# EAGLE design a406-4069-overdrive (EAGLE 7.5.1)
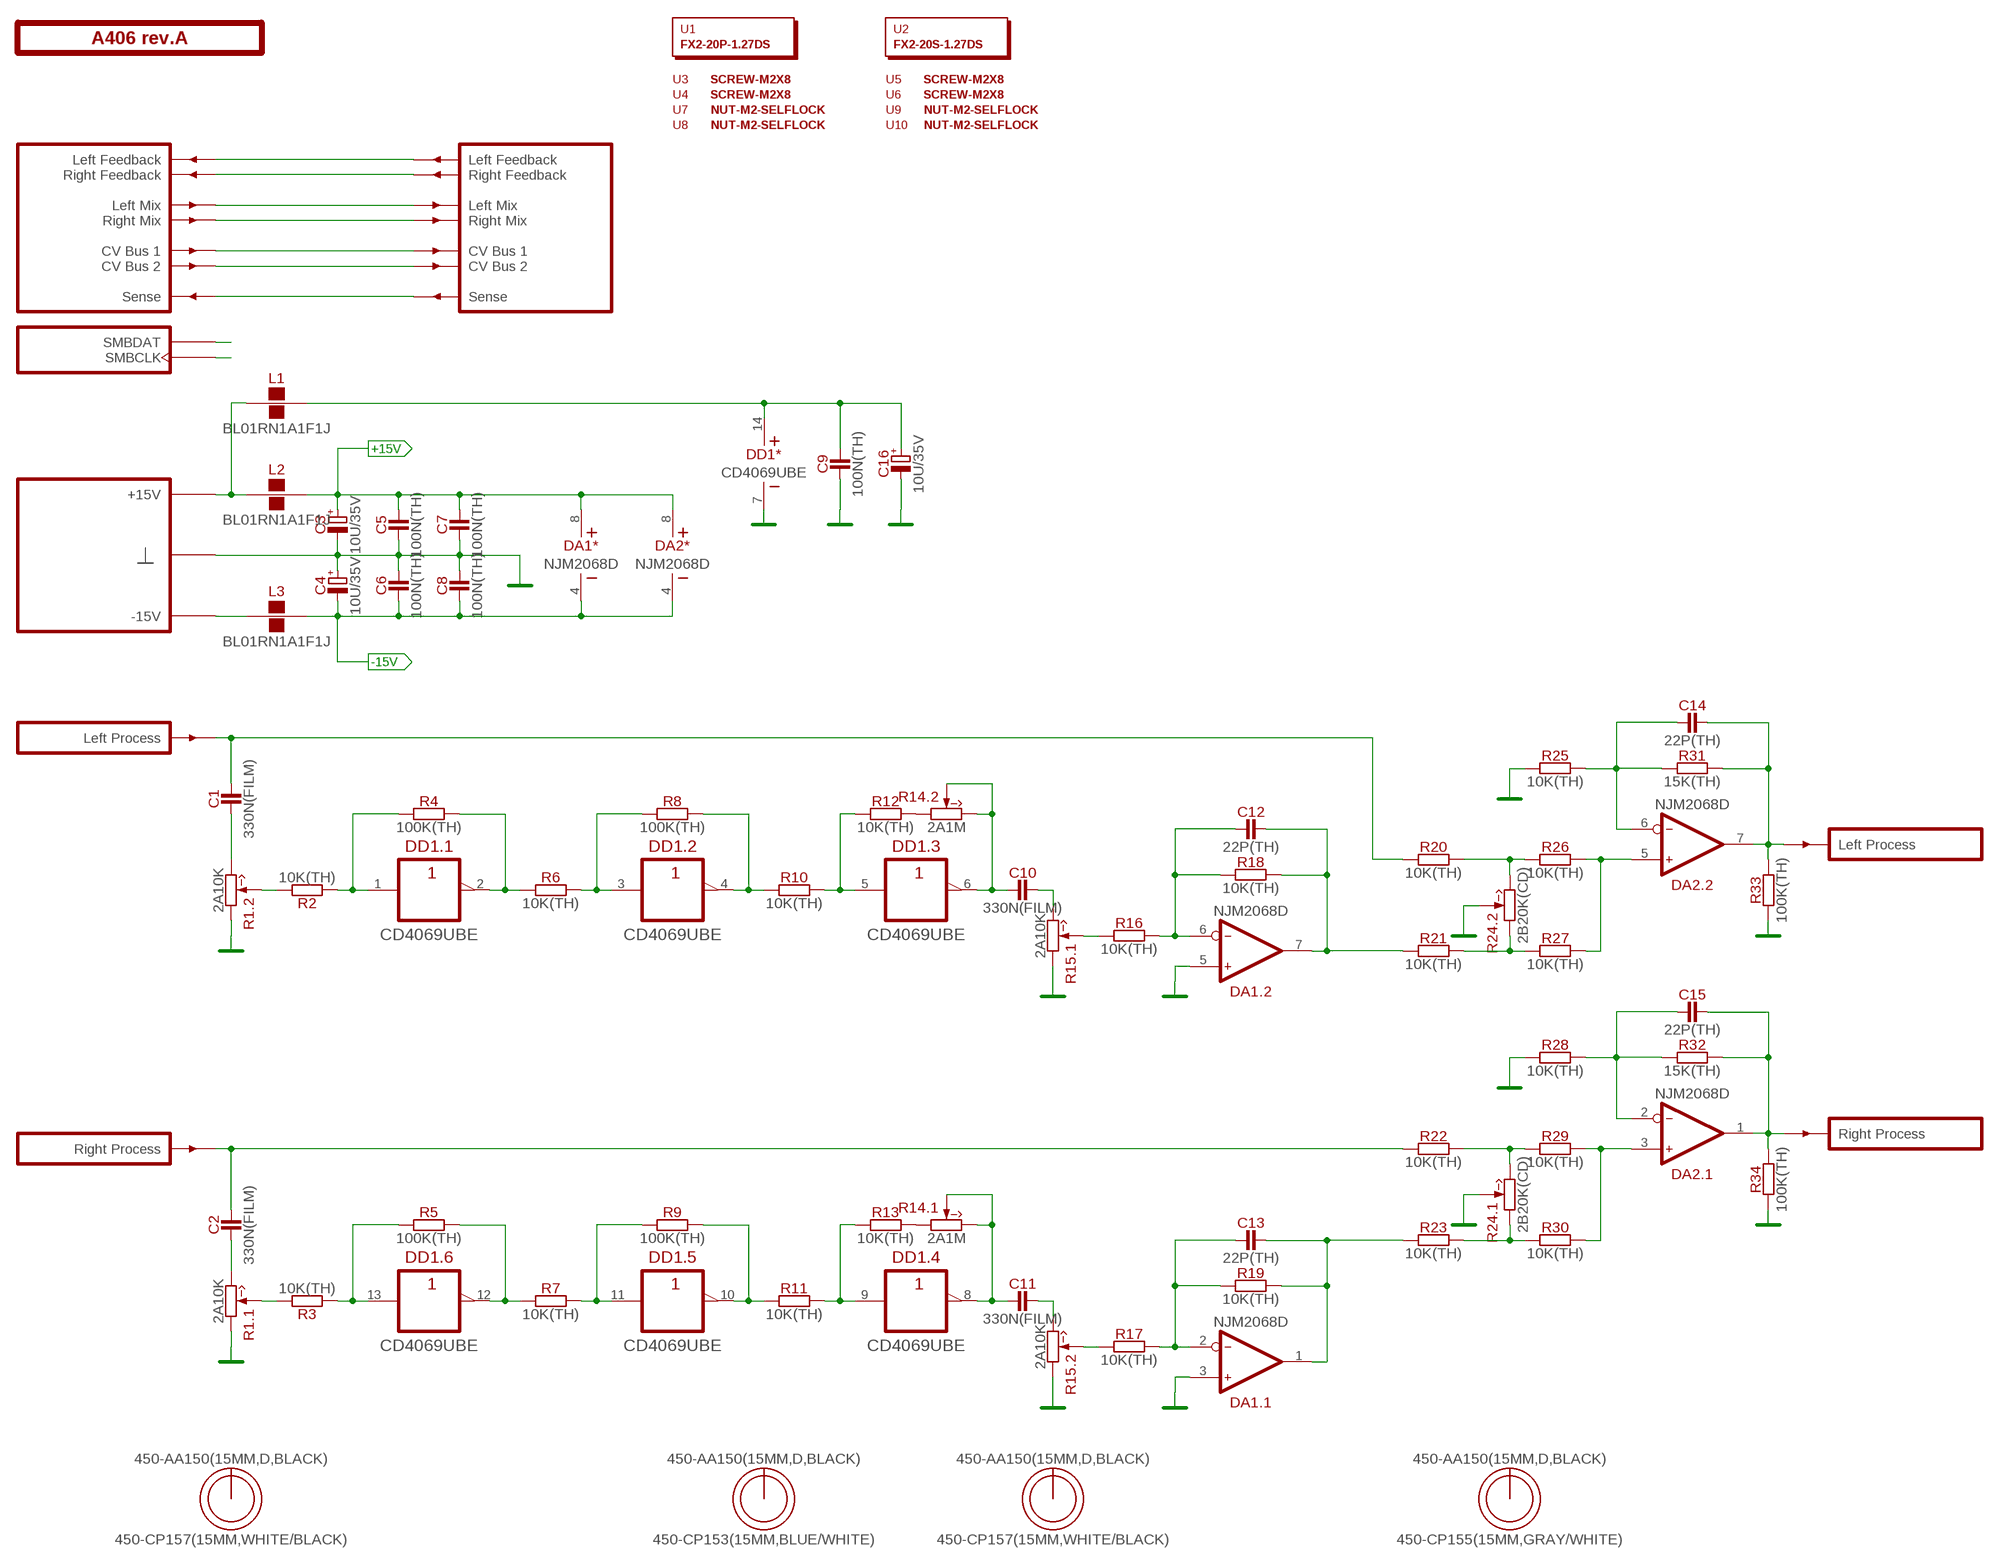
[diagram p0: schematic, sheet 1]

## Parts
C1  330N(FILM)  [C050-035X075]
C2  330N(FILM)  [C050-035X075]
C3  10U/35V  [E2-5]
C4  10U/35V  [E2-5]
C5  100N(TH)  [C050-024X044]
C6  100N(TH)  [C050-024X044]
C7  100N(TH)  [C050-024X044]
C8  100N(TH)  [C050-024X044]
C9  100N(TH)  [C050-024X044]
C10  330N(FILM)  [C050-035X075]
C11  330N(FILM)  [C050-035X075]
C12  22P(TH)  [C050-024X044]
C13  22P(TH)  [C050-024X044]
C14  22P(TH)  [C050-024X044]
C15  22P(TH)  [C050-024X044]
C16  10U/35V  [E2-5]
DA1  NJM2068D  [DIP-8]
DA2  NJM2068D  [DIP-8]
DD1  CD4069UBE  [DIP-14]
L1  BL01RN1A1F1J  [BL01RN1A]
L2  BL01RN1A1F1J  [BL01RN1A]
L3  BL01RN1A1F1J  [BL01RN1A]
O2  450-AA150(15MM,D,BLACK)  [EMPTY]
O3  450-CP157(15MM,WHITE/BLACK)  [EMPTY]
O4  450-AA150(15MM,D,BLACK)  [EMPTY]
O5  450-CP153(15MM,BLUE/WHITE)  [EMPTY]
O6  450-AA150(15MM,D,BLACK)  [EMPTY]
O7  450-CP157(15MM,WHITE/BLACK)  [EMPTY]
O8  450-AA150(15MM,D,BLACK)  [EMPTY]
O9  450-CP155(15MM,GRAY/WHITE)  [EMPTY]
PCB1  A406 rev.A  ST2-BOARD-50  [ST2-BOARD-50]
R1  2A10K  [RV11-DUAL]
R2  10K(TH)  [R-0207/10]
R3  10K(TH)  [R-0207/10]
R4  100K(TH)  [R-0207/10]
R5  100K(TH)  [R-0207/10]
R6  10K(TH)  [R-0207/10]
R7  10K(TH)  [R-0207/10]
R8  100K(TH)  [R-0207/10]
R9  100K(TH)  [R-0207/10]
R10  10K(TH)  [R-0207/10]
R11  10K(TH)  [R-0207/10]
R12  10K(TH)  [R-0207/10]
R13  10K(TH)  [R-0207/10]
R14  2A1M  [RV11-DUAL]
R15  2A10K  [RV11-DUAL]
R16  10K(TH)  [R-0207/10]
R17  10K(TH)  [R-0207/10]
R18  10K(TH)  [R-0207/10]
R19  10K(TH)  [R-0207/10]
R20  10K(TH)  [R-0207/10]
R21  10K(TH)  [R-0207/10]
R22  10K(TH)  [R-0207/10]
R23  10K(TH)  [R-0207/10]
R24  2B20K(CD)  [RV11-DUAL]
R25  10K(TH)  [R-0207/10]
R26  10K(TH)  [R-0207/10]
R27  10K(TH)  [R-0207/10]
R28  10K(TH)  [R-0207/10]
R29  10K(TH)  [R-0207/10]
R30  10K(TH)  [R-0207/10]
R31  15K(TH)  [R-0207/10]
R32  15K(TH)  [R-0207/10]
R33  100K(TH)  [R-0207/10]
R34  100K(TH)  [R-0207/10]
U1  FX2-20P-1.27DS  [EMPTY]
U2  FX2-20S-1.27DS  [EMPTY]
U3  SCREW-M2X8  [EMPTY]
U4  SCREW-M2X8  [EMPTY]
U5  SCREW-M2X8  [EMPTY]
U6  SCREW-M2X8  [EMPTY]
U7  NUT-M2-SELFLOCK  [EMPTY]
U8  NUT-M2-SELFLOCK  [EMPTY]
U9  NUT-M2-SELFLOCK  [EMPTY]
U10  NUT-M2-SELFLOCK  [EMPTY]

## Nets
+15V [power]: C3.+ C5.2 C7.2 DA1.8(*:V+) DA2.8(*:V+) L2.2
-15V [power]: C4.- C6.1 C8.1 DA1.4(*:V-) DA2.4(*:V-) L3.2
FBK_LEFT: PCB1.ALFBK'(LFBK') PCB1.ALFBK(LFBK)
FBK_RIGHT: PCB1.ARFBK'(RFBK') PCB1.ARFBK(RFBK)
GND: C3.- C4.+ C5.1 C6.2 C7.1 C8.2 C9.1 C16.- DA1.3(.1:IN+) DA1.5(.2:IN+) DD1.7(*:V-) PCB1.B4'(GND) PCB1.B4(GND) PCB1.B5'(GND) PCB1.B5(GND) PCB1.B6'(GND) PCB1.B6(GND) PCB1.B7'(GND) PCB1.B7(GND) PCB1.B8'(GND) PCB1.B8(GND) R1.1'(.2:CCW) R1.1(.1:CCW) R15.1'(.2:CCW) R15.1(.1:CCW) R24.2'(.2:W) R24.2(.1:W) R25.1 R28.1 R33.1 R34.1
LMIX: PCB1.ALMIX'(LMIX') PCB1.ALMIX(LMIX)
N$1: C9.2 C16.+ DD1.14(*:V+) L1.2
N$2: R12.2 R14.1'(.2:CCW)
N$3: R13.2 R14.1(.1:CCW)
N$4: C1.2 PCB1.BINL(INL) R20.1
N$5: C1.1 R1.3'(.2:CW)
N$6: DD1.1(.1:A) R2.1 R4.1
N$7: DD1.2(.1:Y) R4.2 R6.1
N$8: DD1.3(.2:A) R6.2 R8.1
N$9: DD1.4(.2:Y) R8.2 R10.1
N$10: DD1.5(.3:A) R10.2 R12.1
N$11: C10.1 DD1.6(.3:Y) R14.2'(.2:W) R14.3'(.2:CW)
N$12: C10.2 R15.3(.1:CW)
N$13: R15.2(.1:W) R16.1
N$14: C12.1 DA1.6(.2:IN-) R16.2 R18.1
N$15: R1.2'(.2:W) R2.2
N$16: PCB1.BSENSE'(SENSE') PCB1.BSENSE(SENSE)
N$17: C12.2 DA1.7(.2:OUT) R18.2 R21.1
N$18: C2.1 R1.3(.1:CW)
N$19: C2.2 PCB1.BINR(INR) R22.1
N$20: R1.2(.1:W) R3.2
N$21: DD1.13(.6:A) R3.1 R5.1
N$22: DD1.12(.6:Y) R5.2 R7.1
N$23: DD1.11(.5:A) R7.2 R9.1
N$24: DD1.10(.5:Y) R9.2 R11.1
N$26: DD1.9(.4:A) R11.2 R13.1
N$27: C11.1 DD1.8(.4:Y) R14.2(.1:W) R14.3(.1:CW)
N$28: C14.2 DA2.7(.2:OUT) PCB1.BOUTL'(OUTL) R31.2 R33.2
N$29: C11.2 R15.3'(.2:CW)
N$30: R15.2'(.2:W) R17.1
N$31: C13.1 DA1.2(.1:IN-) R17.2 R19.1
N$32: C13.2 DA1.1(.1:OUT) R19.2 R23.1
N$33: R20.2 R24.3'(.2:CW) R26.1
N$34: R22.2 R24.3(.1:CW) R29.1
N$35: C15.1 DA2.2(.1:IN-) R28.2 R32.1
N$36: L3.1 PCB1.A-15'(P-15V) PCB1.A-15(P-15V) PCB1.B-15'(P-15V) PCB1.B-15(P-15V)
N$37: C15.2 DA2.1(.1:OUT) PCB1.BOUTR'(OUTR) R32.2 R34.2
N$38: PCB1.ASMBDAT'(SMBDAT) PCB1.ASMBDAT(SMBDAT)
N$39: DA2.3(.1:IN+) R29.2 R30.2
N$40: R23.2 R24.1(.1:CCW) R30.1
N$41: PCB1.ACV1'(CV1') PCB1.ACV1(CV1)
N$42: PCB1.ACV2'(CV2') PCB1.ACV2(CV2)
N$43: PCB1.ASMBCLK'(SMBCLK) PCB1.ASMBCLK(SMBCLK)
N$61: DA2.5(.2:IN+) R26.2 R27.2
N$64: C14.1 DA2.6(.2:IN-) R25.2 R31.1
N$65: R21.2 R24.1'(.2:CCW) R27.1
P+15V: L1.1 L2.1 PCB1.A+15'(P+15V) PCB1.A+15(P+15V) PCB1.B+15'(P+15V) PCB1.B+15(P+15V)
RMIX: PCB1.ARMIX'(RMIX') PCB1.ARMIX(RMIX)

## Library data of the parts
C1 C2 C10 C11 = capacitors:?; MOUSER: 505-MKS2.33/63/10
C3 C4 C16 = capacitors-electrolytic:?; MOUSER: 647-USW1V100MDD
C5-C9 = capacitors:?; MOUSER: 81-RCER71H104K0A2H3B
C12-C15 = capacitors:?
DA1 DA2 = ic-jrc:NJM2068; MOUSER: 513-NJM2068D
DD1 = ic-logic:CD4069UB
L1-L3 = inductors:BL01RN1A?; MOUSER: 81-BL01RN1A1F1J
O2 O4 O6 O8 = hardware:450-AA?; MOUSER: 450-AA150
O3 O7 = hardware:450-C?; MOUSER: 450-CP157
O5 = hardware:450-C?; MOUSER: 450-CP153
O9 = hardware:450-C?; MOUSER: 450-CP155
PCB1 = module-footprints:ST2-BOARD-?
R1 R15 = potentiometers:2**?; MOUSER: 688-RK12L12C0A0E
R2 R3 R6 R7 R10-R13 R16-R23 R25-R30 = resistors:?; MOUSER: 71-RN55D-F-10K
R4 R5 R8 R9 R33 R34 = resistors:?; MOUSER: 71-RN55D-F-100K
R14 = potentiometers:2**?; MOUSER: 317-2102F-1M
R24 = potentiometers:2**?; MOUSER: 688-RK12L1230C1M
R31 R32 = resistors:?
U1 = hardware:?; MOUSER: 798-FX2-20P-1.27DS71
U2 = hardware:?; MOUSER: 798-FX2-20S-1.27DS71
U3-U10 = hardware:*?

## Board
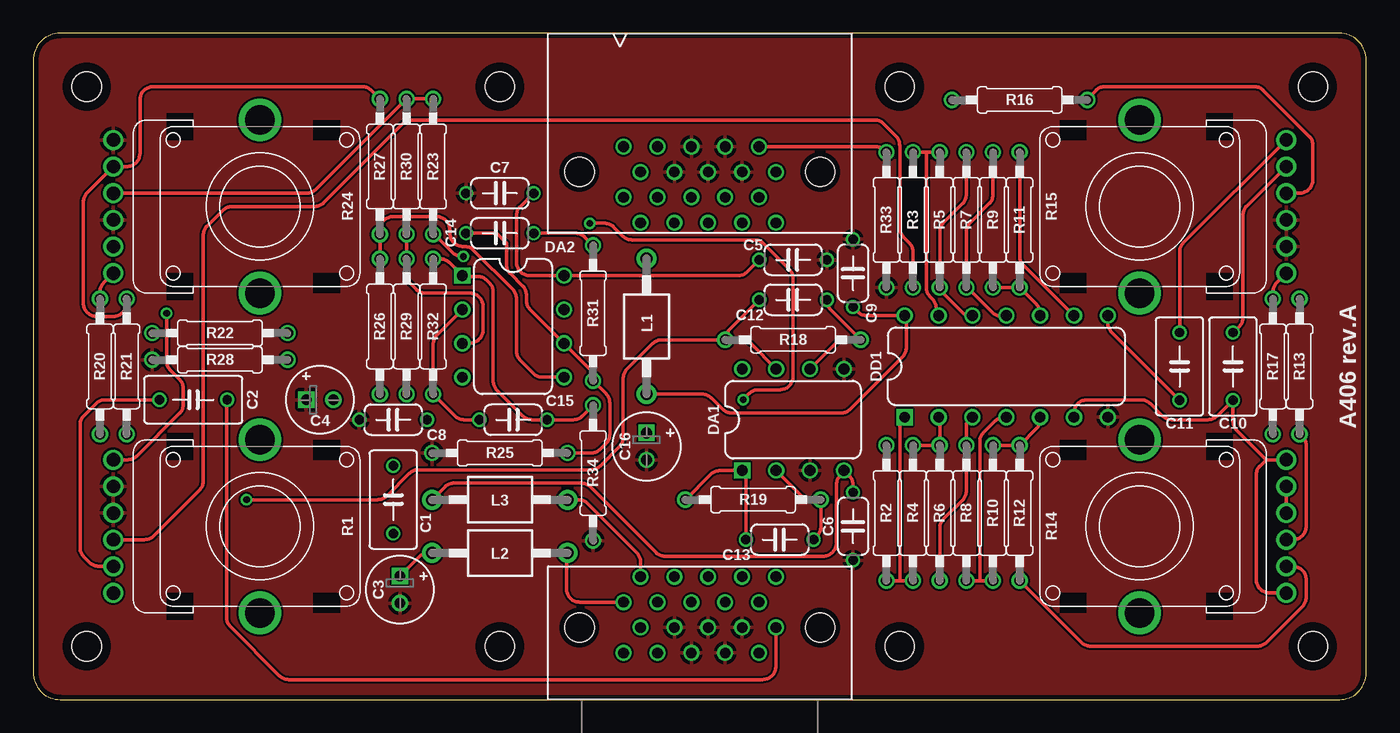
[diagram p1: board, top side]
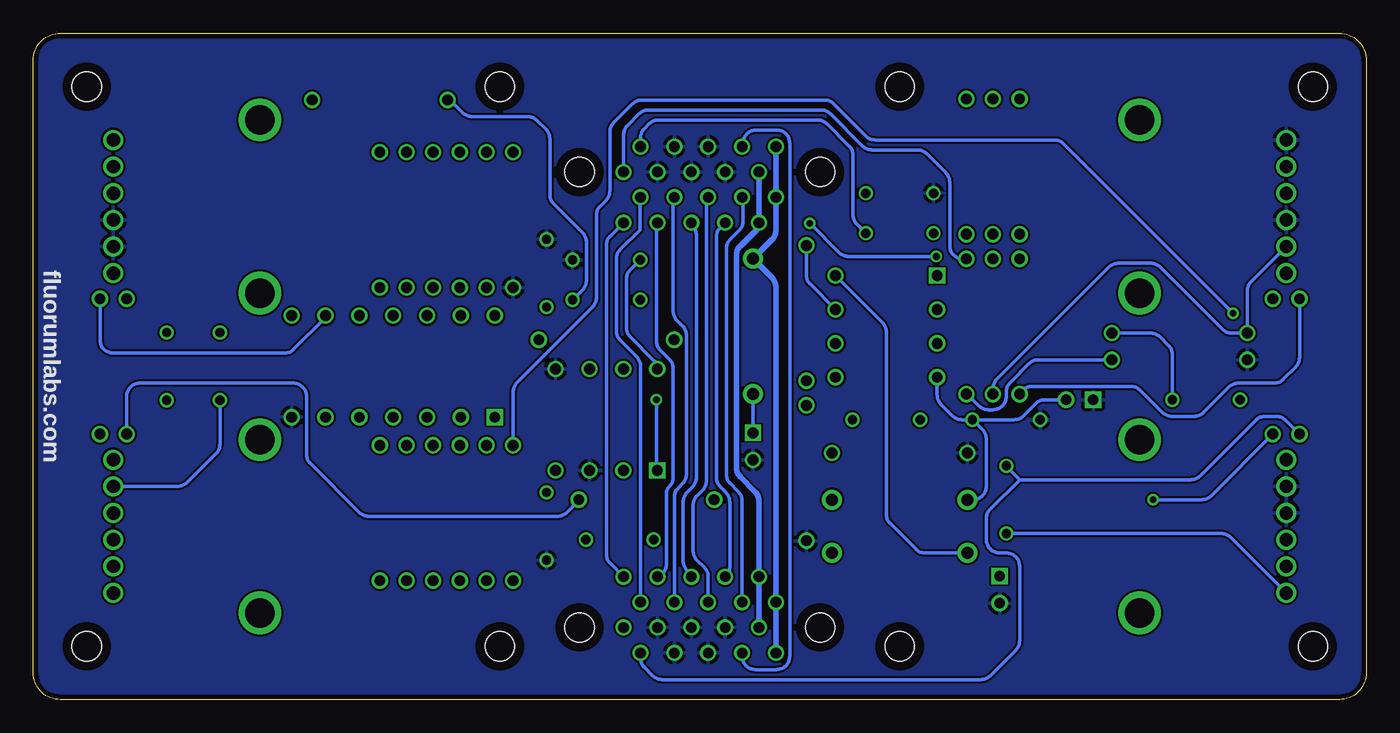
[diagram p2: board, bottom side, seen from below]

Size 100 x 50 mm. Coordinates in mm from the lower left corner, seen from the top.
Outline: 100,2 100,48 arc90 98,50 2,50 arc90 0,48 0,2 arc90 2,0 98,0 arc90 100,2
Copper layers (1*16): Top 0.0356mm / dielectric 1.5011mm / Bottom 0.0356mm
Design rules "LaenPCBOrder": minimum track width 6mil, minimum drill 13mil, track to track 6mil, track to pad 6mil, pad to pad 6mil, via to via 6mil, smd to smd 6mil, copper to edge 15mil, drill to drill 6mil, minimum pad ring 7mil, minimum via ring 7mil, stop-mask expansion 3mil, vias tented up to drill 0mil, thermal gap 10mil

### Footprints (pad centres in the part's own frame; a part is rotated, then mirrored left to right if it is on the bottom)
C050-035X075 = drill 0.7: 1 -2.54,0; 2 2.54,0
E2-5 = drill 0.813 square: + -1.016,0 | drill 0.813: - 1.016,0
C050-024X044 = drill 0.7: 1 -2.54,0; 2 2.54,0
DIP-8 = drill 0.813 square: 1 -3.81,-3.81 | drill 0.813: 2 -1.27,-3.81; 3 1.27,-3.81; 4 3.81,-3.81; 5 3.81,3.81; 6 1.27,3.81; 7 -1.27,3.81; 8 -3.81,3.81
DIP-14 = drill 0.813 square: 1 -7.62,-3.81 | drill 0.813: 2 -5.08,-3.81; 3 -2.54,-3.81; 4 0,-3.81; 5 2.54,-3.81; 6 5.08,-3.81; 7 7.62,-3.81; 8 7.62,3.81; 9 5.08,3.81; 10 2.54,3.81; 11 0,3.81; 12 -2.54,3.81; 13 -5.08,3.81; 14 -7.62,3.81
BL01RN1A = drill 0.9 pad 1.5: 1 -5.08,0; 2 5.08,0
ST2-BOARD-50 = drill 0.8: A+15 44.285,7.31; A+15' 44.285,37.69; A-15 45.555,9.215; A-15' 45.555,35.785; ACV1 51.905,7.31; ACV1' 51.905,37.69; ACV2 53.175,9.215; ACV2' 53.175,35.785; ALFBK 49.365,7.31; ALFBK' 49.365,37.69; ALMIX 46.825,7.31; ALMIX' 46.825,37.69; ARFBK 50.635,9.215; ARFBK' 50.635,35.785; ARMIX 48.095,9.215; ARMIX' 48.095,35.785; ASMBCLK 55.715,9.215; ASMBCLK' 55.715,35.785; ASMBDAT 54.445,7.31; ASMBDAT' 54.445,37.69; B4 48.095,5.405; B4' 48.095,39.595; B5 49.365,3.5; B5' 49.365,41.5; B6 50.635,5.405; B6' 50.635,39.595; B7 51.905,3.5; B7' 51.905,41.5; B8 53.175,5.405; B8' 53.175,39.595; B+15 44.285,3.5; B+15' 44.285,41.5; B-15 45.555,5.405; B-15' 45.555,39.595; BINL 54.445,3.5; BINR 55.715,5.405; BOUTL' 54.445,41.5; BOUTR' 55.715,39.595; BSENSE 46.825,3.5; BSENSE' 46.825,41.5 | hole 2.2: 4,4; 4,46; 96,4; 96,46; 35,46; 65,46; 65,4; 35,4; 59.025,5.405; 40.975,5.405; 40.975,39.595; 59.025,39.595
RV11-DUAL = drill 1: 1 -1,-11; 1' -3,-11; 2 1,-11; 2' -5,-11; 3 3,-11; 3' 5,-11 | drill 2.2: S1 -6.5,0; S2 6.5,0
R-0207/10 = drill 0.813: 1 -5.08,0; 2 5.08,0

### Placement (x,y rotation side)
C1  27,15 90 top
C2  12,22.5 0 top
C3  27.5,8.25 270 top
C4  21.5,22.5 0 top
C5  57,33 180 top
C6  61.5,13 270 top
C7  35,38 0 top
C8  27,21 180 top
C9  61.5,32 270 top
C10  90,25 90 top
C11  86,25 90 top
C12  57,30 180 top
C13  56,12 180 top
C14  35,35 0 top
C15  36,21 0 top
C16  46,19 270 top
DA1  57,21 0 top
DA2  36,28 270 top
DD1  73,25 0 top
L1  46,28 270 top
L2  35,11 180 top
L3  35,15 180 top
O2  50,-101.75 0 top  (outside the outline)
O3  52.25,-101.75 0 top  (outside the outline)
O4  54.5,-101.75 0 top  (outside the outline)
O5  56.75,-101.75 0 top  (outside the outline)
O6  59,-101.75 0 top  (outside the outline)
O7  61.25,-101.75 0 top  (outside the outline)
O8  63.5,-101.75 0 top  (outside the outline)
O9  65.75,-101.75 0 top  (outside the outline)
PCB1  0,0 0 top
R1  2*A10K  [RV11-DUAL]  17,13 270 top
R2  64,14 90 top
R3  66,36 270 top
R4  66,14 90 top
R5  68,36 270 top
R6  68,14 270 top
R7  70,36 270 top
R8  70,14 270 top
R9  72,36 270 top
R10  72,14 90 top
R11  74,36 90 top
R12  74,14 270 top
R13  95,25 270 top
R14  2*A1M  [RV11-DUAL]  83,13 90 top
R15  2*A10K  [RV11-DUAL]  83,37 90 top
R16  74,45 180 top
R17  93,25 270 top
R18  57,27 180 top
R19  54,15 180 top
R20  5,25 90 top
R21  7,25 90 top
R22  14,27.5 180 top
R23  30,40 90 top
R24  2*B20K(CD)  [RV11-DUAL]  17,37 270 top
R25  35,18.5 0 top
R26  26,28 90 top
R27  26,40 270 top
R28  14,25.5 0 top
R29  28,28 90 top
R30  28,40 270 top
R31  42,29 90 top
R32  30,28 90 top
R33  64,36 90 top
R34  42,17 90 top
U1  68,-101.75 0 top  (outside the outline)
U2  70.25,-101.75 0 top  (outside the outline)
U3  72.5,-101.75 0 top  (outside the outline)
U4  74.75,-101.75 0 top  (outside the outline)
U5  77,-101.75 0 top  (outside the outline)
U6  79.25,-101.75 0 top  (outside the outline)
U7  81.5,-101.75 0 top  (outside the outline)
U8  83.75,-101.75 0 top  (outside the outline)
U9  86,-101.75 0 top  (outside the outline)
U10  88.25,-101.75 0 top  (outside the outline)

### Tracks (layer width: path | path; a pad name or v marks a point on that pad's centre or on a via)
+15V
  Top 0.254: C7.2 36.54,37 arc45 36.25,36.3 36.25,32.81 arc90 37.25,31.81 DA2.8 52.86,31.81 arc45 53.56,32.1 C5.2 | L2.2 29.65,11 arc45 28.94,10.71 C3.+
  Bottom 0.254: DA1.8 arc-45 53.46,25.46 55.21,27.21 arc45 55.5,27.91 55.5,31.55 arc45 55.21,32.25 C5.2 | L2.2 33.09,11 arc45 33.79,11.29 35.71,13.21 arc45 36,13.91 36,27.59 arc-45 36.29,28.29 DA2.8
-15V
  Top 0.254: C6.1 61.5,16.09 arc45 61.21,16.79 DA1.4 60.81,17.06 60.54,16.79 arc45 60.25,16.09 60.25,11.75 arc-90 59.25,10.75 47.41,10.75 arc-45 46.71,11.04 41.79,15.96 arc45 41.09,16.25 31.58,16.25 arc45 30.88,15.96 L3.2
  Bottom 0.254: DA2.4 32.19,22.85 arc-45 31.9,22.15 31.04,21.29 arc-45 30.34,21 C8.1 | L3.2 29.5,15 arc-90 28.5,16 28.5,19.55 arc-45 28.79,20.25 C8.1 | C4.- 24.09,22.5 arc-45 24.79,22.21 25.71,21.29 arc45 26.41,21 C8.1
FBK_LEFT
  Bottom 0.254: PCB1.ALFBK 49.37,9.2 arc-45 49.66,9.91 50.21,10.46 arc45 50.5,11.16 50.5,14.59 arc45 50.21,15.29 49.79,15.71 arc-45 49.5,16.41 49.5,37.36 arc45 PCB1.ALFBK'
FBK_RIGHT
  Bottom 0.254: PCB1.ARFBK' 50.63,35.63 50.54,35.54 arc45 50.25,34.84 50.25,16.66 arc45 50.54,15.96 50.96,15.54 arc-45 51.25,14.84 51.25,10.41 arc-45 50.96,9.71 50.63,9.38 PCB1.ARFBK
GND
  pour Bottom: 98,0 2,0 arc-90 0,2 0,48 arc-90 2,50 98,50 arc-90 100,48 100,2 arc-90
  pour Top: 98,0 2,0 arc-90 0,2 0,48 arc-90 2,50 98,50 arc-90 100,48 100,2 arc-90
LMIX
  Bottom 0.254: PCB1.ALMIX 46.83,14.91 arc-45 47.12,15.62 47.71,16.21 arc45 48,16.91 48,33.84 arc45 47.71,34.54 47.04,35.21 arc-45 46.75,35.91 46.75,37.62 PCB1.ALMIX'
N$1
  Top 0.254: C9.2 61.86,29.1 arc45 62.56,28.81 DD1.14 65.5,28.69 65.5,26.41 arc-45 65.21,25.71 61.29,21.79 arc-45 60.59,21.5 52.41,21.5 arc-45 51.71,21.79 50.87,22.63 arc45 50.17,22.92 L1.2
  Bottom 0.254: C16.+ L1.2
N$2
  Top 0.254: R14.1' 94.5,10 arc-90 95.5,9 95.5,7.66 arc-45 95.21,6.96 92.54,4.29 arc-45 91.84,4 79.33,4 arc-45 78.63,4.29 R12.2
N$3
  Top 0.254: R13.2 95.08,19.92 95.21,19.79 arc-45 95.5,19.09 95.5,13 arc-90 94.5,12 R14.1
N$4
  Bottom 0.254: C1.2 27,17.5 26,16.5 | 26,16.5 13.16,16.5 arc-45 12.46,16.79 8.29,20.96 arc45 7.59,21.25 6.74,21.25 arc45 6.04,20.96 R20.1 | PCB1.BINL 54.45,3.11 arc-45 54.15,2.4 53.54,1.79 arc-45 52.84,1.5 28.91,1.5 arc-45 28.21,1.79 26.29,3.71 arc-45 26,4.41 26,10 arc-90 27,11 27.5,11 arc90 28.5,12 28.5,13.59 arc45 28.21,14.29 26,16.5
N$5
  Bottom 0.254: C1.1 10.87,12.46 arc45 10.17,12.17 R1.3'
N$6
  Top 0.254: R2.1 65,8.92 | 65,8.92 R4.1 | DD1.1 65.38,21.13 65.29,21.04 arc45 65,20.34 65,8.92
N$7
  Top 0.254: R4.2 R6.1 68,21 arc45 DD1.2
N$8
  Top 0.254: DD1.3 70,20.73 R8.1 70,15.66 arc-45 69.71,14.96 68.29,13.54 arc45 68,12.84 R6.2
N$9
  Top 0.254: DD1.4 72.85,21.19 arc45 72.15,20.9 71.29,20.04 arc45 71,19.34 71,8.92 | R8.2 71,8.92 | 71,8.92 R10.1
N$10
  Top 0.254: R10.2 R12.1 75.25,20.33 arc45 75.54,21.03 DD1.5
N$11
  Top 0.254: DD1.6 78.08,21.5 arc-90 79.08,22.5 83.09,22.5 arc-45 83.79,22.21 84.71,21.29 arc45 85.41,21 88.13,21 arc45 88.83,21.29 C10.1 90,20.91 arc45 90.29,20.21 92.5,18 | R14.3' 92.5,18 | 92.5,18 92.04,17.54 arc45 91.75,16.84 91.75,9 arc90 92.75,8 R14.2'
N$12
  Top 0.254: C10.2 90.04,27.54 90.46,27.96 arc45 90.75,28.66 90.75,36.34 arc-45 91.04,37.04 R15.3
N$13
  Top 0.254: R16.1 79.08,45.08 79.71,45.71 arc-45 80.41,46 91.59,46 arc-45 92.29,45.71 95.71,42.29 arc-45 96,41.59 96,39 arc-90 95,38 R15.2
N$14
  Top 0.254: C12.1 59.54,29.95 arc45 59.83,29.25 R18.1 60.87,27 arc45 60.17,26.71 DA1.6
  Bottom 0.254: R16.2 68.75,45 67.79,44.04 arc-45 67.09,43.75 62.91,43.75 arc45 62.21,43.46 61.54,42.79 arc45 61.25,42.09 61.25,37.91 arc-45 60.96,37.21 58.79,35.04 arc45 58.5,34.34 58.5,31.45 arc45 58.79,30.75 C12.1
N$15  (via drill 0.5)
  Top 0.254: v10,29 10,25.41 arc45 10.29,24.71 10.96,24.04 arc-45 11.25,23.34 11.25,22.16 arc-45 10.96,21.46 7.79,18.29 arc-45 7.09,18 R1.2'
  Bottom 0.254: R2.2 64,23.09 arc45 63.71,23.79 58.04,29.46 arc-45 57.75,30.16 57.75,36.34 arc45 57.46,37.04 57.04,37.46 arc-45 56.75,38.16 56.75,42.59 arc45 56.46,43.29 55.04,44.71 arc45 54.34,45 40.66,45 arc45 39.96,44.71 37.54,42.29 arc-45 36.84,42 23.41,42 arc45 22.71,41.71 v10,29
N$16
  Bottom 0.254: PCB1.BSENSE 46.83,3.25 arc-90 45.83,2.25 44.25,2.25 arc-90 43.25,3.25 43.25,41.75 arc-90 44.25,42.75 45.75,42.75 arc-90 46.75,41.75 46.75,41.58 PCB1.BSENSE'
N$17  (via drill 0.5)
  Top 0.254: R18.2 53.13,27 arc-45 53.83,26.71 DA1.7 | R18.2 51.92,27.05 arc-45 52.21,27.75 C12.2 | R18.2 47.16,27 arc45 46.46,26.71 44.54,24.79 arc45 44.25,24.09 44.25,19.66 arc-45 43.96,18.96 42.54,17.54 arc-45 41.84,17.25 28.91,17.25 arc45 28.21,16.96 26.54,15.29 arc-45 25.84,15 v16,15
  Bottom 0.254: v16,15 12.33,15 arc-45 11.63,15.29 R21.1
N$18
  Top 0.254: R1.3 4.91,10 arc-45 4.21,10.29 3.79,10.71 arc-45 3.5,11.41 3.5,20.59 arc-45 3.79,21.29 4.71,22.21 arc-45 5.41,22.5 C2.1
N$19
  Top 0.254: PCB1.BINR 55.72,2.5 arc-90 54.72,1.5 19.16,1.5 arc-45 18.46,1.79 14.79,5.46 arc-45 14.5,6.16 14.5,22.46 C2.2
  Bottom 0.254: C2.2 14.54,25.88 arc-45 14.83,26.58 15.46,27.21 arc-45 16.16,27.5 R22.1
N$20
  Top 0.254: R3.2 66,33.59 arc45 65.71,34.29 65.29,34.71 arc-45 65,35.41 65,41.59 arc45 64.71,42.29 63.79,43.21 arc45 63.09,43.5 28.41,43.5 arc45 27.71,43.21 21.79,37.29 arc-45 21.09,37 14.91,37 arc45 14.21,36.71 13.04,35.54 arc45 12.75,34.84 12.75,16.41 arc-45 12.46,15.71 9.04,12.29 arc-45 8.34,12 R1.2
N$21
  Top 0.254: R3.1 67,41.08 | 67,41.08 R5.1 | 67,41.08 67,30.91 arc45 67.29,30.21 67.46,30.04 arc-45 67.75,29.34 67.75,28.98 DD1.13
N$22
  Top 0.254: DD1.12 70.4,28.75 arc-45 69.72,29.03 68,30.75 R5.2 68,35.09 arc-45 68.29,35.79 69.71,37.21 arc45 70,37.91 R7.1
N$23
  Top 0.254: DD1.11 72.94,28.75 72.66,28.75 arc-45 71.96,29.04 70.08,30.92 R7.2 70,35.09 arc-45 70.29,35.79 71.71,37.21 arc45 72,37.91 R9.1
N$24
  Top 0.254: R9.2 R11.1 75.25,29.67 arc-45 75.54,28.97 DD1.10
N$26
  Top 0.254: R11.2 74,33.3 arc45 74.29,32.6 DD1.9
  Bottom 0.254: DD1.9 78.08,28.67 80.46,26.29 arc45 81.16,26 94,26 arc90 95,27 R13.1
N$27
  Top 0.254: DD1.8 80.62,28.25 arc45 80.91,27.55 C11.1 | R14.2 R14.3
  Bottom 0.254: C11.1 86,19.16 arc45 86.29,18.46 88.46,16.29 arc45 89.16,16 R14.3
N$28
  Top 0.254: C14.2 40.67,35 arc-45 41.37,34.71 R31.2 | PCB1.BOUTL' 63.17,41.5 arc-45 63.87,41.21 R33.2
  Bottom 0.254: R31.2 42,31.87 arc-45 41.71,31.17 DA2.7 | PCB1.BOUTL' 54.45,42.14 arc45 54.15,42.85 53.79,43.21 arc45 53.09,43.5 41.16,43.5 arc45 40.46,43.21 38.79,41.54 arc45 38.5,40.84 38.5,36.37 arc-45 38.21,35.67 C14.2
N$29
  Top 0.254: C11.2 86,33.59 arc-45 86.29,34.29 R15.3'
N$30
  Top 0.254: R17.1 93,30.59 arc-45 93.29,31.29 R15.2'
N$31
  Top 0.254: DA1.2 57.63,15.29 arc45 58.33,15 R19.1 59.08,12.95 arc-45 58.79,12.25 C13.1
  Bottom 0.254: R19.1 59.08,14.92 59.96,14.04 arc45 60.66,13.75 74.84,13.75 arc45 75.54,14.04 79.21,17.71 arc45 79.5,18.41 79.5,22.75 arc-90 80.5,23.75 92,23.75 arc-90 93,22.75 R17.2
N$32  (via drill 0.5)
  Top 0.254: C13.2 53.46,16.92 DA1.1 51.52,17.19 arc45 50.82,16.9 R19.2 | R23.1 30.08,34.92 31.46,33.54 arc45 32.16,33.25 v32.25,33.25 | v41.75,35.75 42.84,35.75 arc-45 43.54,35.46 44.21,34.79 arc45 44.91,34.5 54.09,34.5 arc-45 54.79,34.21 56.71,32.29 arc-45 57,31.59 57,24.25 arc-90 56,23.25 54.41,23.25 arc45 53.71,22.96 v53.25,22.5
  Bottom 0.254: v32.25,33.25 38.84,33.25 arc45 39.54,33.54 v41.75,35.75 | v53.25,22.5 53.25,17.25 DA1.1
N$33
  Top 0.254: R20.2 5,30.59 arc-45 5.29,31.29 R24.3'
  Bottom 0.254: R26.1 26,23 25.79,23.21 arc45 25.09,23.5 17.66,23.5 arc45 16.96,23.21 15.29,21.54 arc-45 14.59,21.25 12.91,21.25 arc-45 12.21,21.54 10.29,23.46 arc45 9.59,23.75 6.91,23.75 arc-45 6.21,24.04 5.29,24.96 arc-45 5,25.66 R20.2
N$34
  Bottom 0.254: R24.3 8.63,31.37 arc-45 8.92,30.67 R22.2 10.09,27.5 arc45 10.79,27.79 15.46,32.46 arc-45 16.16,32.75 18.59,32.75 arc-45 19.29,32.46 27.71,24.04 arc-45 28,23.34 R29.1
N$35
  Top 0.254: DA2.2 30.29,27.37 arc45 30,26.67 R32.1 31.63,21.29 arc45 32.33,21 C15.1
  Bottom 0.254: R32.1 29.92,22.92 29.04,22.04 arc-45 28.34,21.75 28,21.75 arc-90 27,22.75 27,23.09 arc45 26.71,23.79 25.29,25.21 arc45 24.59,25.5 R28.2
N$36
  Top 0.254: L3.1 40.89,15 arc-45 41.6,14.71 45.26,11.04 arc-45 45.55,10.34 PCB1.A-15
  Bottom 0.406: PCB1.B-15 PCB1.A-15 45.55,14.89 arc-45 45.85,15.6 46.96,16.71 arc45 47.25,17.41 47.25,33.34 arc45 46.96,34.04 45.75,35.25 45.75,35.59 PCB1.A-15' PCB1.B-15'
N$37
  Top 0.254: R32.2 30.51,33.08 arc-45 31.21,32.79 DA2.1 32.25,31.75 33.34,31.75 arc-45 34.04,31.46 34.21,31.29 arc-45 34.5,30.59 34.5,23.91 arc45 34.79,23.21 36.71,21.29 arc45 37.41,21 C15.2 40.51,21 arc45 41.21,21.29 R34.2
  Bottom 0.254: PCB1.BOUTR' 55.72,42.37 arc45 55.42,43.08 54.54,43.96 arc45 53.84,44.25 40.91,44.25 arc45 40.21,43.96 37.79,41.54 arc-45 37.09,41.25 33.66,41.25 arc45 32.96,40.96 31.54,39.54 arc45 31.25,38.84 31.25,34.08 arc-90 30.25,33.08 R32.2
N$38
  Bottom 0.254: PCB1.ASMBDAT 54.45,25.03 arc-45 54.74,25.74 55.96,26.96 arc45 56.25,27.66 56.25,33.09 arc45 55.96,33.79 54.5,35.25 54.5,37.63 PCB1.ASMBDAT'
N$39
  Top 0.254: R30.2 R29.2 28,31.91 arc45 28.29,31.21 28.71,30.79 arc45 29.41,30.5 32.75,30.5 arc-90 33.75,29.5 33.75,27.75 arc-90 32.75,26.75 32.21,26.75 DA2.3
N$40
  Top 0.254: R24.1 20.51,38 arc45 21.21,38.29 R30.1 R23.2
N$41
  Bottom 0.254: PCB1.ACV1 51.91,15.18 arc45 51.61,15.89 51.29,16.21 arc-45 51,16.91 51,27.34 arc-45 51.29,28.04 51.71,28.46 arc45 52,29.16 52,37.59 PCB1.ACV1'
N$42
  Bottom 0.254: PCB1.ACV2 53.03,9.21 52.79,9.46 arc-45 52.5,10.16 52.5,15.46 arc45 52.29,15.96 arc-45 52,16.66 52,24.84 arc-45 52.29,25.54 52.96,26.21 arc45 53.25,26.91 53.25,35.71 PCB1.ACV2'
N$43
  Bottom 0.254: PCB1.ASMBCLK 56.71,10.21 arc45 57,10.91 57,34.09 arc45 56.71,34.79 PCB1.ASMBCLK'
N$61
  Top 0.254: R26.2 R27.2 26,35.25 arc-90 27,36.25 30.25,36.25 arc-90 31.25,35.25 31.25,35 arc90 32.25,34 32.34,34 arc-45 33.04,33.71 35.96,30.79 arc-45 36.25,30.09 36.25,26.16 arc45 36.54,25.46 37.52,24.48 arc45 38.22,24.19 DA2.5
N$64
  Top 0.254: R25.2 41.84,18.5 arc45 42.54,18.79 42.96,19.21 arc45 43.25,19.91 43.25,22.26 arc45 42.96,22.96 R31.1 42,24.54 DA2.6 37.29,29.25 arc-45 37,29.95 37,30.34 arc45 36.71,31.04 35.79,31.96 arc-45 35.5,32.66 35.5,34.25 34.75,35 C14.1
N$65
  Top 0.254: R27.1 25.37,45.71 arc45 24.67,46 9,46 arc90 8,45 8,41 arc-90 7,40 R24.1' 4.04,38.04 arc45 3.75,37.34 3.75,29.75 arc90 4.75,28.75 6,28.75 arc90 7,29.75 R21.2
P+15V
  Top 0.254: PCB1.A+15 41,7.31 arc-90 40,8.31 40,10.92 L2.1
  Bottom 0.406: PCB1.B+15 PCB1.A+15 44.28,30.95 arc-45 44.58,31.66 L1.1 44.58,34.5 arc-45 44.28,35.21 PCB1.A+15' PCB1.B+15'
RMIX
  Bottom 0.254: PCB1.ARMIX 48.03,9.21 arc-45 47.75,9.9 47.75,14.84 arc-45 48.04,15.54 48.46,15.96 arc45 48.75,16.66 48.75,34.72 arc45 48.46,35.42 PCB1.ARMIX'